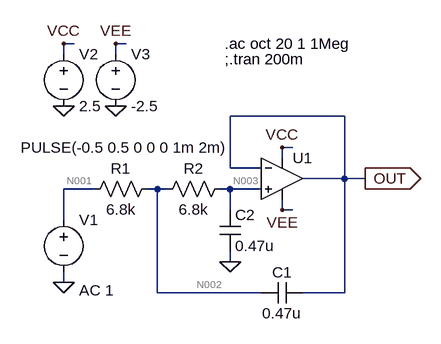
[diagram p0: schematic Noise_Filter_02.asc]
Noise_Filter_02.asc, the LTspice schematic file:
Version 4
SHEET 1 880 680
WIRE -96 -48 -112 -48
WIRE -16 -48 -32 -48
WIRE -112 -32 -112 -48
WIRE -32 -32 -32 -48
WIRE 320 64 144 64
WIRE 240 112 224 112
WIRE 224 128 224 112
WIRE 144 144 144 64
WIRE 192 144 144 144
WIRE 320 160 320 64
WIRE 320 160 256 160
WIRE 352 160 320 160
WIRE -64 176 -112 176
WIRE 32 176 16 176
WIRE 48 176 32 176
WIRE 144 176 128 176
WIRE 192 176 144 176
WIRE 144 208 144 176
WIRE 224 208 224 192
WIRE 240 208 224 208
WIRE -112 224 -112 176
WIRE 144 288 144 272
WIRE -112 320 -112 304
WIRE 32 336 32 176
WIRE 192 336 32 336
WIRE 320 336 320 160
WIRE 320 336 256 336
FLAG 224 112 VCC
FLAG 224 208 VEE
FLAG 144 288 0
FLAG -112 320 0
FLAG 352 160 OUT
IOPIN 352 160 Out
FLAG -112 48 0
FLAG -32 48 0
FLAG -112 -48 VCC
FLAG -32 -48 VEE
SYMBOL Opamps\\UniversalOpamp2 224 160 R0
SYMATTR InstName U1
SYMBOL res 32 160 R90
WINDOW 0 0 56 VBottom 2
WINDOW 3 32 56 VTop 2
SYMATTR InstName R1
SYMATTR Value 6.8k
SYMBOL cap 128 208 R0
SYMATTR InstName C2
SYMATTR Value 0.47u
SYMBOL res 144 160 R90
WINDOW 0 0 56 VBottom 2
WINDOW 3 32 56 VTop 2
SYMATTR InstName R2
SYMATTR Value 6.8k
SYMBOL cap 256 320 R90
WINDOW 0 0 32 VBottom 2
WINDOW 3 32 32 VTop 2
SYMATTR InstName C1
SYMATTR Value 0.47u
SYMBOL voltage -112 208 R0
WINDOW 123 24 124 Left 2
WINDOW 39 0 0 Left 0
WINDOW 3 -66 -96 Left 2
SYMATTR Value2 AC 1
SYMATTR Value PULSE(-0.5 0.5 0 0 0 1m 2m)
SYMATTR InstName V1
SYMBOL voltage -112 -48 R0
WINDOW 123 0 0 Left 0
WINDOW 39 0 0 Left 0
SYMATTR InstName V2
SYMATTR Value 2.5
SYMBOL voltage -32 -48 R0
WINDOW 123 0 0 Left 0
WINDOW 39 0 0 Left 0
SYMATTR InstName V3
SYMATTR Value -2.5
TEXT 136 -48 Left 2 !.ac oct 20 1 1Meg
TEXT 136 -24 Left 2 !;.tran 200m

The netlist it stands for:
* Noise_Filter_02.asc
XU1 N003 OUT VCC VEE OUT level.2 Avol=1Meg GBW=10Meg Slew=10Meg ilimit=25m rail=0 Vos=0 phimargin=45 en=0 enk=0 in=0 ink=0 Rin=500Meg  ; pins IN+ IN- V+ V- OUT
R1 N002 N001 6.8k
C2 N003 0 0.47u
R2 N003 N002 6.8k
C1 OUT N002 0.47u
V1 N001 0 PULSE(-0.5 0.5 0 0 0 1m 2m) AC 1
V2 VCC 0 2.5
V3 VEE 0 -2.5
.ac oct 20 1 1Meg
;.tran 200m
.lib UniversalOpamps2.sub
.backanno
.end

* Results of the author's LTspice run, read from the files saved beside the schematic
* Operating Point, zero values left out:
*   V(out) = -500 mV
*   V(vcc) = 2.5 V
*   V(vee) = -2.5 V
*   V(n003) = -500 mV
*   V(n002) = -500 mV
*   V(n001) = -500 mV
*   I(R2) = 1 nA
*   I(R1) = 1 nA
*   I(V3) = 245 µA
*   I(V2) = -245 µA
*   I(V1) = 1 nA
*   Ix(u1:1) = -1 nA
*   Ix(u1:2) = -1 nA
*   Ix(u1:3) = 245 µA
*   Ix(u1:4) = -245 µA
*   Ix(u1:5) = 1 nA
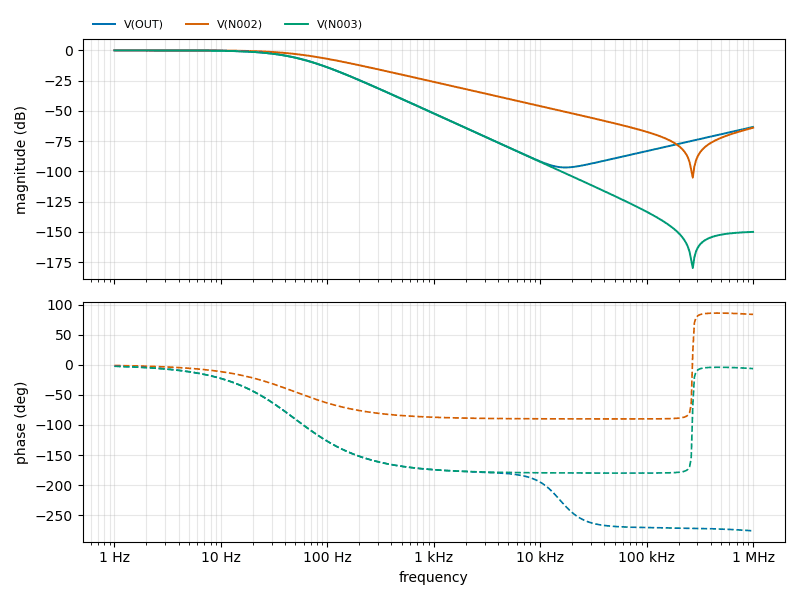
[diagram p1: AC Analysis of Noise_Filter_02.asc, plotted from the saved traces]
* AC Analysis, 1 run:
*   V(OUT): -0.00 dB at 1 Hz, -63.34 dB at 1 MHz, peak -0.00 dB at 1 Hz, 3 dB below the peak at 32.07 Hz
*   V(N002): -0.00 dB at 1 Hz, -64.00 dB at 1 MHz, peak -0.00 dB at 1 Hz, 3 dB below the peak at 49.81 Hz
*   V(N003): -0.00 dB at 1 Hz, -150.05 dB at 1 MHz, peak -0.00 dB at 1 Hz, 3 dB below the peak at 32.07 Hz